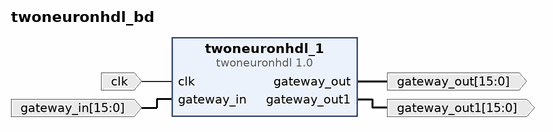
[diagram p0: block diagram of the top level]
# Vivado block design twoneuronhdl_bd, xc7z020clg484-1, Vivado 2021.1
create_bd_design twoneuronhdl_bd

create_bd_port -dir I -type clk clk
create_bd_port -dir I -from 15 -to 0 -type data gateway_in
create_bd_port -dir O -from 15 -to 0 -type data gateway_out
create_bd_port -dir O -from 15 -to 0 -type data gateway_out1

create_bd_cell -type ip -vlnv User_Company:SysGen:twoneuronhdl:1.0 twoneuronhdl_1

# ---- connections ----

connect_bd_net [get_bd_ports clk] [get_bd_pins twoneuronhdl_1/clk]
connect_bd_net [get_bd_ports gateway_in] [get_bd_pins twoneuronhdl_1/gateway_in]
connect_bd_net [get_bd_pins twoneuronhdl_1/gateway_out] [get_bd_ports gateway_out]
connect_bd_net [get_bd_pins twoneuronhdl_1/gateway_out1] [get_bd_ports gateway_out1]

validate_bd_design
save_bd_design
